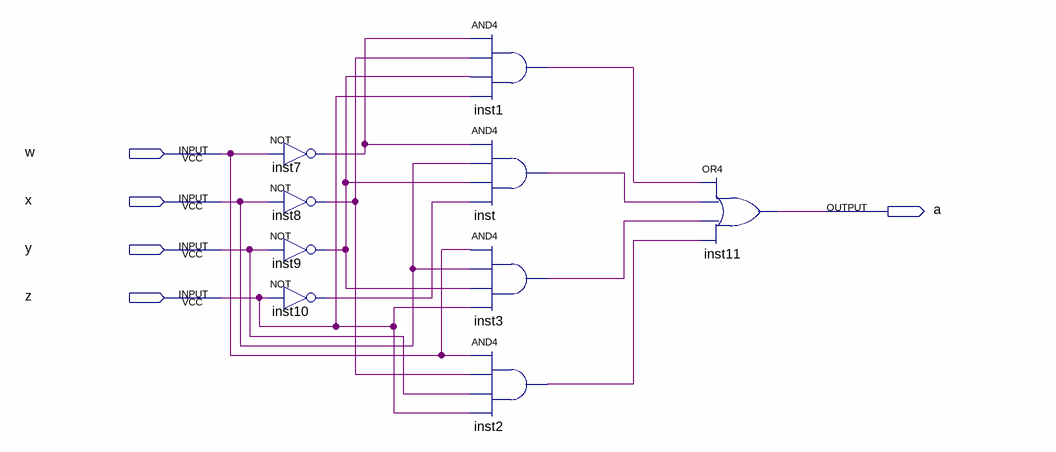
[diagram p0: schematic sheet]
// Quartus schematic A.bdf as structural Verilog: 9 symbols, 5 pins
module A (
  input  w,
  input  x,
  input  y,
  input  z,
  output a
);

  wire inst1_out, inst2_out, inst3_out, inst7_out, inst8_out, inst9_out, inst10_out, inst_out;

  not inst7 (inst7_out, w);
  not inst8 (inst8_out, x);
  not inst9 (inst9_out, y);
  not inst10 (inst10_out, z);
  and inst1 (inst1_out, inst7_out, inst8_out, inst9_out, z);
  and inst (inst_out, inst7_out, x, inst9_out, inst10_out);
  and inst3 (inst3_out, w, x, inst9_out, z);
  and inst2 (inst2_out, w, inst8_out, y, z);
  or inst11 (a, inst1_out, inst_out, inst3_out, inst2_out);
endmodule
